# Altium schematic sheet Sheet4_LCD_Interface.SchDoc: =ProjectName
size A4; DocumentNumber: 4; SheetNumber: 4; SheetTotal: 5
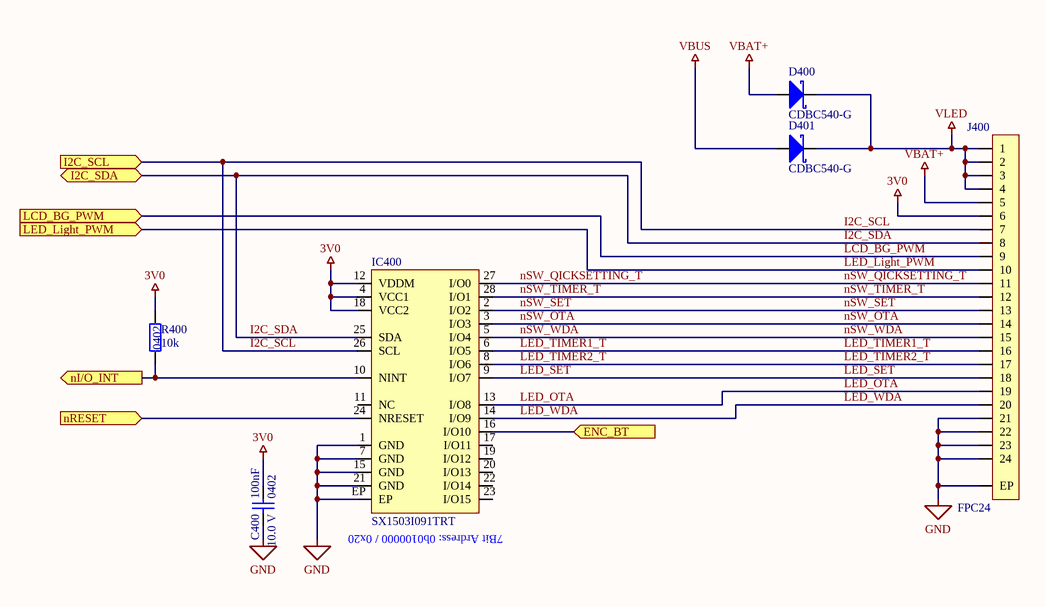
[diagram p0: Sheet4_LCD_Interface.SchDoc]

## Parts
C400  Capacitance: 100nF  Footprint: 0402  Voltage: 10.0 V  [C_0402]  (hidden comment: C 100nF 0402 10V)
D400  Manufacturer Part Number: CDBC540-G  [DO-214AB]  (hidden comment: D SCH 40V 5A)
D401  Manufacturer Part Number: CDBC540-G  [DO-214AB]  (hidden comment: D SCH 40V 5A)
IC400  SX1503I091TRT  [UFQFN-28-EP]
J400  FPC24  [J_FPC_522712479]
R400  Resistance: 10k  Footprint: 0402  [R_0402]  (hidden comment: R 10k 0402)

## Ports
ENC_BT (in), I2C_SCL (in), I2C_SDA (bidir), LCD_BG_PWM (in), LED_Light_PWM (in), nI/O_INT (out), nRESET (in)

## Nets
3V0: C400.2 IC400.4(VCC1) IC400.12(VDDM) IC400.18(VCC2) J400.6 R400.2
GND: C400.1 IC400.1(GND) IC400.7(GND) IC400.15(GND) IC400.21(GND) IC400.EP J400.21 J400.22 J400.23 J400.24 J400.EP
VBAT+: D400.2(A) J400.5
VBUS: D401.2(A)
VLED: D400.1(K) D401.1(K) J400.1 J400.2 J400.3 J400.4
ENC_BT: IC400.16(I/O10) ; port ENC_BT
I2C_SCL: IC400.26(SCL) J400.7 ; port I2C_SCL
I2C_SDA: IC400.25(SDA) J400.8 ; port I2C_SDA
LCD_BG_PWM: J400.9 ; port LCD_BG_PWM
LED_Light_PWM: J400.10 ; port LED_Light_PWM
LED_OTA: IC400.13(I/O8) J400.19
LED_SET: IC400.9(I/O7) J400.18
LED_TIMER1_T: IC400.6(I/O5) J400.16
LED_TIMER2_T: IC400.8(I/O6) J400.17
LED_WDA: IC400.14(I/O9) J400.20
nI/O_INT: IC400.10(NINT) R400.1 ; port nI/O_INT
nRESET: IC400.24(NRESET) ; port nRESET
nSW_OTA: IC400.3(I/O3) J400.14
nSW_QICKSETTING_T: IC400.27(I/O0) J400.11
nSW_SET: IC400.2(I/O2) J400.13
nSW_TIMER_T: IC400.28(I/O1) J400.12
nSW_WDA: IC400.5(I/O4) J400.15

Not connected (* = marked no-connect by the designer): IC400 11(NC) 17(I/O11) 19(I/O12) 20(I/O13) 22(I/O14) 23(I/O15)

## Notes on the sheet
- (near IC400) 7Bit Ardress: 0b0100000 / 0x20
- Title
- Size:
- Date:
- A4
- Number:
- Time:
- Revision:
- Sheet
- of
- File:

## Library data of the parts
C400 = CAP_100nF_10V_0402: CAP CER 0.1UF 10V X5R 0402; Manufacturer: Samsung Electro-Mechanics; Manufacturer Part Number: CL05A104MP5NNNC; Type: Capacitor; Supplier 1: Digi-Key; Supplier Part Number 1: 1276-1443-1-ND
D400 D401 = D_SCH_40V_5A: DIODE SCHOTTKY 40V 5A DO214AB; Manufacturer: Comchip Technology; Type: Diode; Supplier 1: Digi-Key; Supplier Part Number 1: 641-1126-1-ND
IC400 = IC_16ch_Port_Extender_2: IC GPIO EXPANDER I2C 16CH 28-QFN; Manufacturer: Semtech Corporation; Manufacturer Part Number: SX1503I091TRT; Type: IC, Driver; Supplier 1: Digi-Key; Supplier Part Number 1: SX1503I091CT-ND
J400 = J_FPC24_DS: CONN FPC BOT 24 PIN 1mm Pitch; Manufacturer: MOLEX; Manufacturer Part Number: 522712479; Pitch: 1.0; Type: Connector; Supplier 1: LCSC; Supplier Part Number 1: C293627; Pins: 24
R400 = R_10k_0402: RES 10K OHM 1% 1/16W 0402; Manufacturer: YAGEO; Manufacturer Part Number: RC0402FR-0710KL; Type: Resistor; Supplier 1: Digi-Key; Supplier Part Number 1: 311-10.0KLRCT-ND